# Altium schematic sheet 蓝桥3.SchDoc
size A2
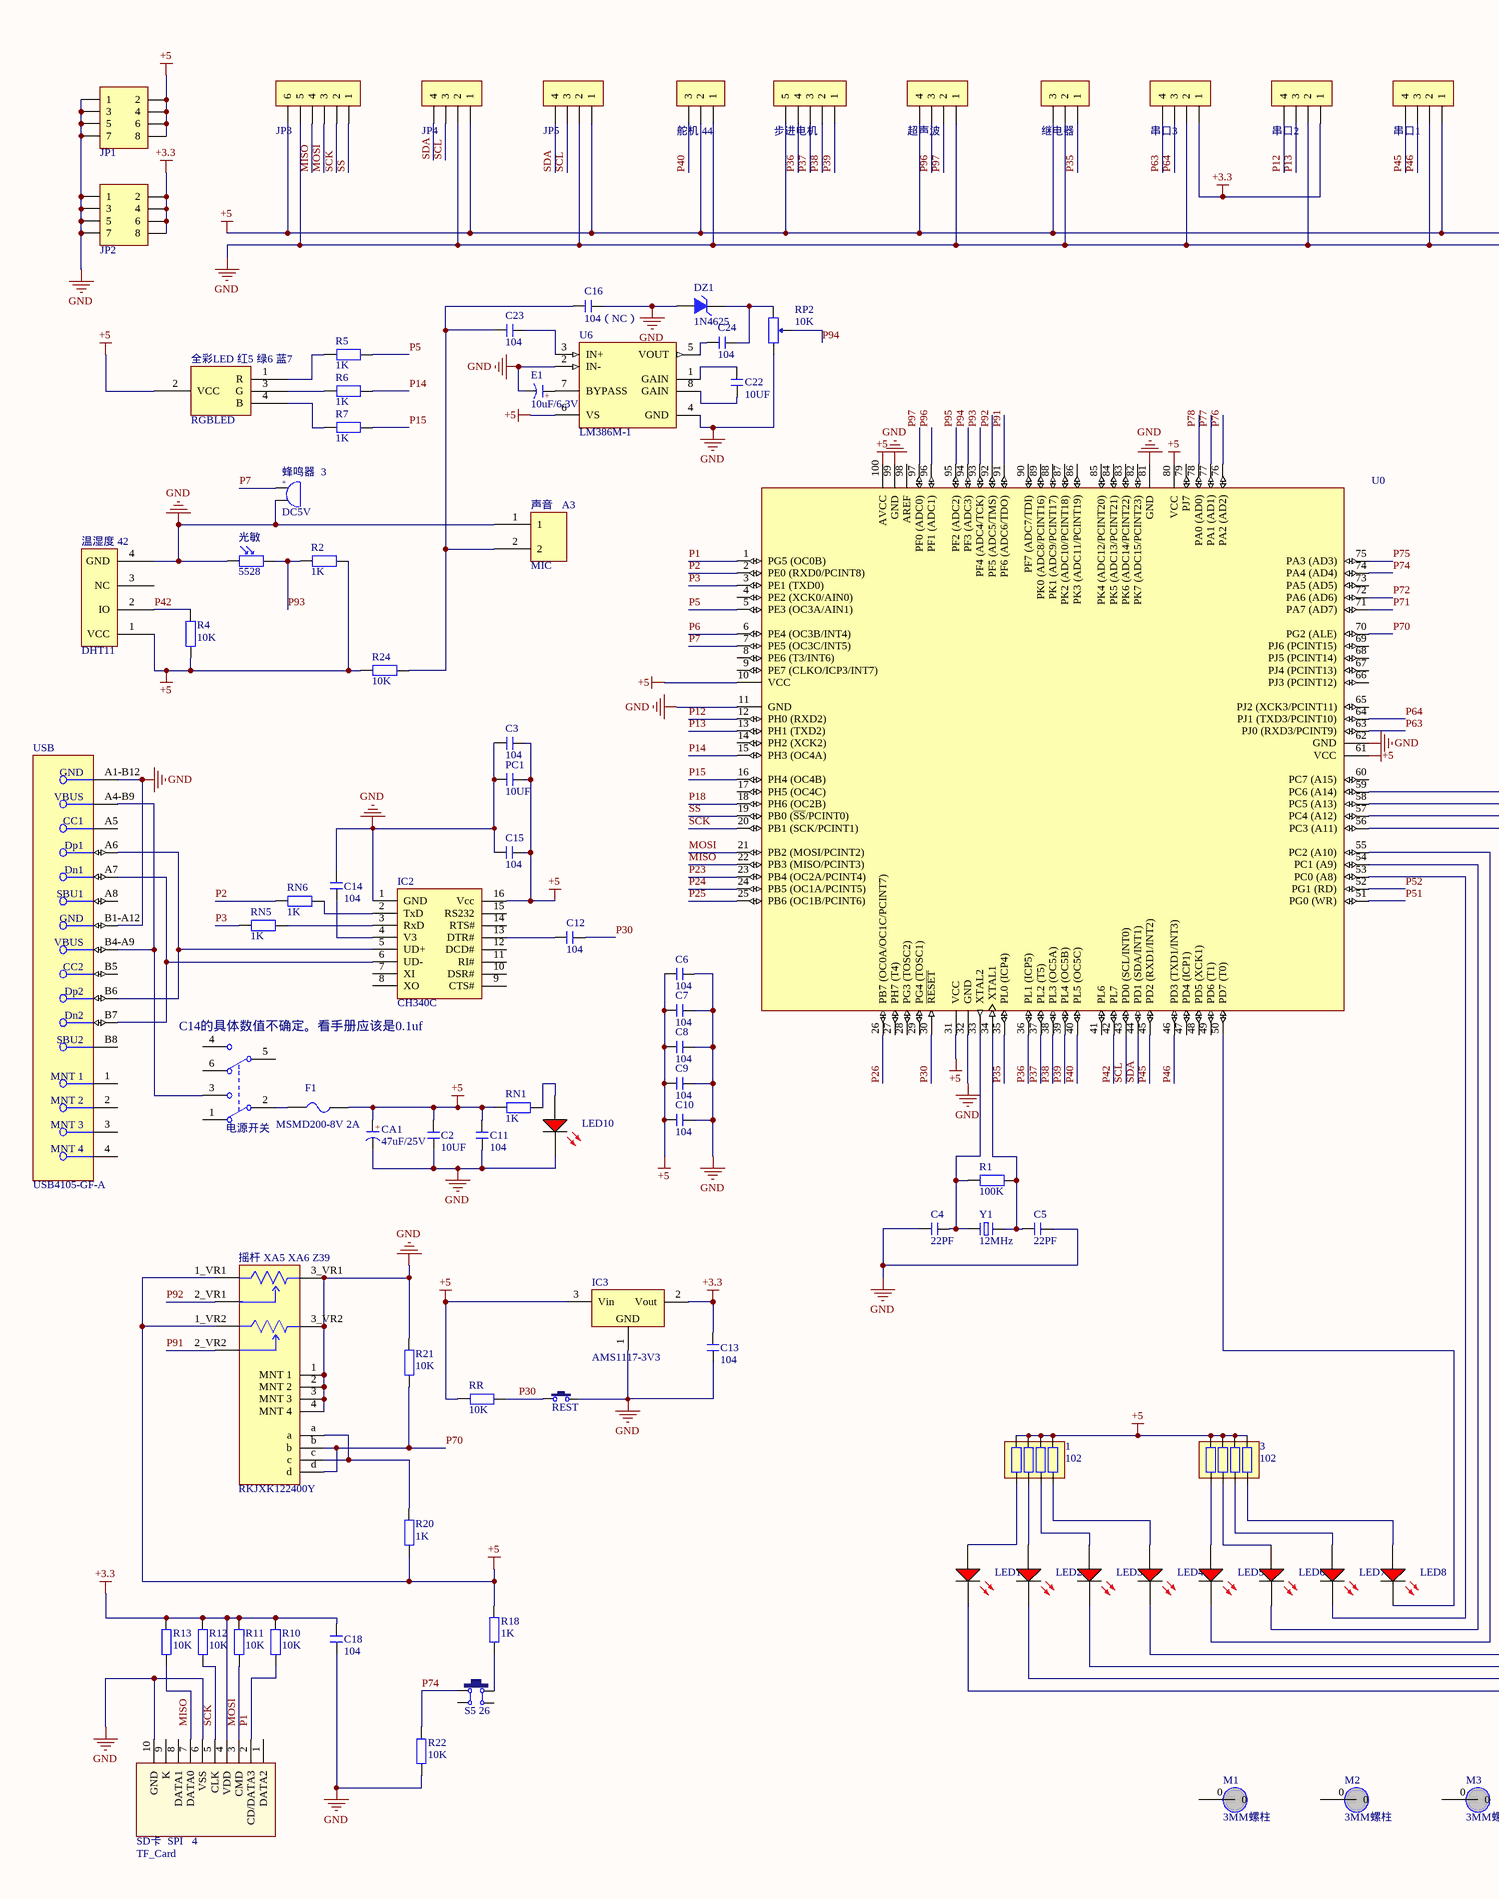
[diagram p0: 蓝桥3.SchDoc, left]
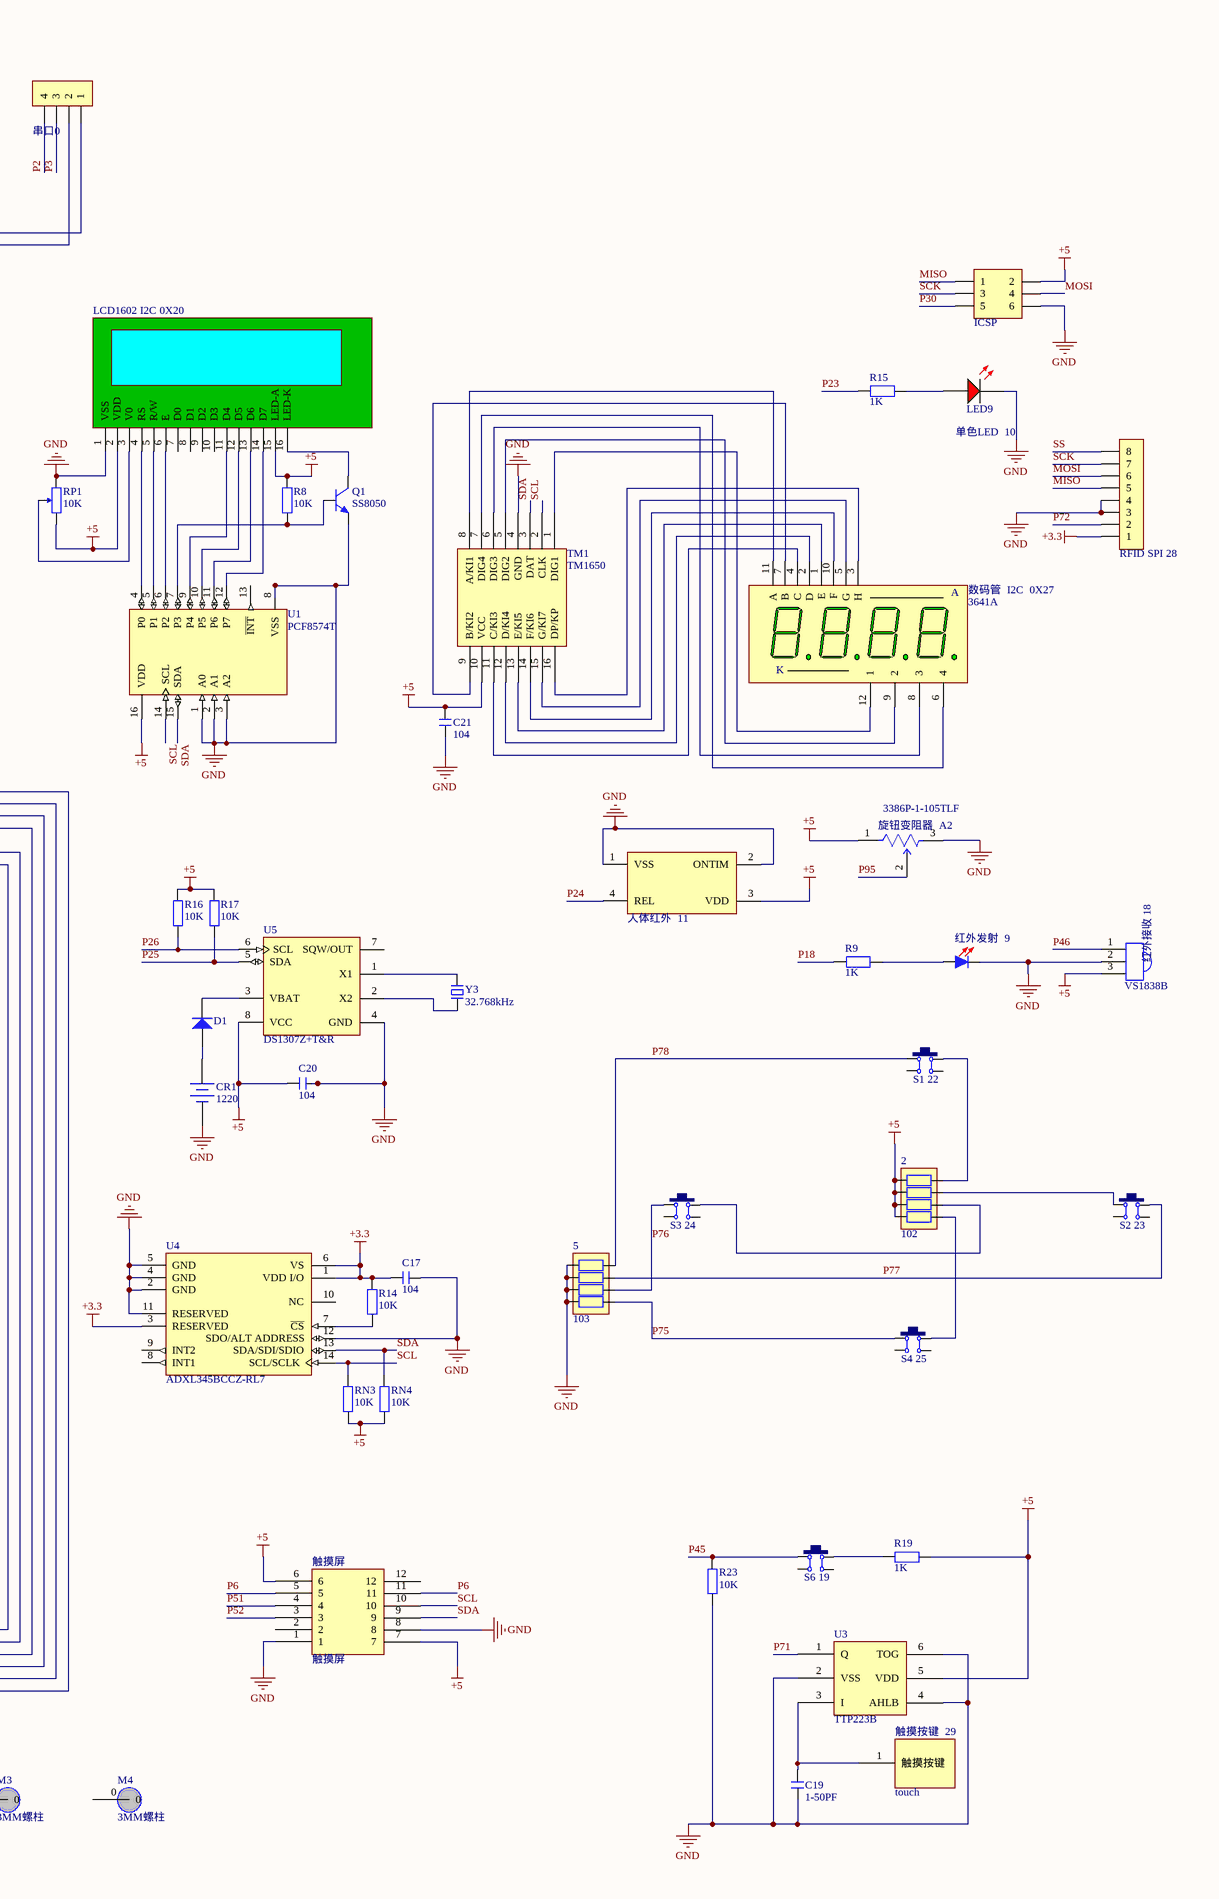
[diagram p1: 蓝桥3.SchDoc, right]

## Parts
1  102  [RCA-8P4R-0603]
2  102  [RCA-8P4R-0603]
3  102  [RCA-8P4R-0603]
5  103  [RCA-8P4R-0603]
C2  10UF  [C 0805_L]
C3  104  [C 0805_L]
C4  22PF  [C 0805_L]
C5  22PF  [C 0805_L]
C6  104  [C 0805_L]
C7  104  [C 0805_L]
C8  104  [C 0805_L]
C9  104  [C 0805_L]
C10  104  [C 0805_L]
C11  104  [C 0805_L]
C12  104  [C 0805_L]
C13  104  [C 0805_L]
C14  104  [C 0805_L]
C15  104  [C 0805_L]
C16  104（NC）  [C 0805_L]
C17  104  [C 0805_L]
C18  104  [C 0805_L]
C19  1-50PF  [C 0805_L]
C20  104  [C 0805_L]
C21  104  [C 0805_L]
C22  10UF  [C 0805_L]
C23  104  [C 0805_L]
C24  104  [C 0805_L]
CA1  47uF/25V  [CM D(6.3*5.4)]
CR1  1220  [CR1220_A]
D1  (no value)  [MINI_MELF (LL34)]
DZ1  1N4625  [MINI_MELF (LL34)]
E1  10uF/6.3V  [CD A(3216)]
F1  MSMD200-8V 2A  [FU 1812]
IC2  CH340C  [SOP16_L]
IC3  AMS1117-3V3  [SOT89_N]
ICSP  Header3X2  [HDR2.54-LI-2x3P]  (value not drawn)
JP1  Header 4X2  [HDR2.54-LI-2x4P]  (value not drawn)
JP2  Header 4X2  [HDR2.54-LI-2x4P]  (value not drawn)
JP3  HDR-1X6  [XH2.54-WI-6P]  (value not drawn)
JP4  HDR-1X4  [XH2.54-WI-4P]  (value not drawn)
JP5  HDR-1X4  [XH2.54-WI-4P]  (value not drawn)
LCD1602_I2C_0X20  LCD 1602  [LCD-1602]  (value not drawn)
LED1  31  [LUMX-SML-LXT0805_V]  (value not drawn)
LED2  32  [LUMX-SML-LXT0805_V]  (value not drawn)
LED3  33  [LUMX-SML-LXT0805_V]  (value not drawn)
LED4  34  [LUMX-SML-LXT0805_V]  (value not drawn)
LED5  35  [LUMX-SML-LXT0805_V]  (value not drawn)
LED6  36  [LUMX-SML-LXT0805_V]  (value not drawn)
LED7  37  [LUMX-SML-LXT0805_V]  (value not drawn)
LED8  38  [LUMX-SML-LXT0805_V]  (value not drawn)
LED9  38  [LUMX-SML-LXT0805_V]  (value not drawn)
LED10  31  [LUMX-SML-LXT0805_V]  (value not drawn)
M1  3MM螺柱  [3mm螺柱]
M2  3MM螺柱  [3mm螺柱]
M3  3MM螺柱  [3mm螺柱]
M4  3MM螺柱  [3mm螺柱]
PC1  10UF  [C 0805_L]
Q1  SS8050  [SOT23-3N]
R1  100K  [R 0805_L]
R2  1K  [R 0805_L]
R4  10K  [R 0805_L]
R5  1K  [R 0805_L]
R6  1K  [R 0805_L]
R7  1K  [R 0805_L]
R8  10K  [R 0805_L]
R9  1K  [R 0805_L]
R10  10K  [R 0805_L]
R11  10K  [R 0805_L]
R12  10K  [R 0805_L]
R13  10K  [R 0805_L]
R14  10K  [R 0805_L]
R15  1K  [R 0805_L]
R16  10K  [R 0805_L]
R17  10K  [R 0805_L]
R18  1K  [R 0805_L]
R19  1K  [R 0805_L]
R20  1K  [R 0805_L]
R21  10K  [R 0805_L]
R22  10K  [R 0805_L]
R23  10K  [R 0805_L]
R24  10K  [R 0805_L]
REST  3x6x5  [TSW SMD-3*6*2.5]  (value not drawn)
RFID_SPI_28  HDR-1X8  [XH2.54-WI-8P]  (value not drawn)
RN1  1K  [R 0805_L]
RN3  10K  [R 0805_L]
RN4  10K  [R 0805_L]
RN5  1K  [R 0805_L]
RN6  1K  [R 0805_L]
RP1  10K  [3303W]
RP2  10K  [3303W]
RR  10K  [R 0805_L]
S1_22  12x12x5  [TSW DIP-12*12*4.3]  (value not drawn)
S2_23  12x12x5  [TSW DIP-12*12*4.3]  (value not drawn)
S3_24  12x12x5  [TSW DIP-12*12*4.3]  (value not drawn)
S4_25  12x12x5  [TSW DIP-12*12*4.3]  (value not drawn)
S5_26  12x12x5  [TSW DIP-12*12*4.3]  (value not drawn)
S6_19  12x12x5  [TSW DIP-12*12*4.3]  (value not drawn)
SD卡_SPI_4  TF_Card  [Micro SD]
TM1  TM1650  [SOP16]
U0  atmega2560  [LQFP100 14x14_M]  (value not drawn)
U1  PCF8574T  [FP-SOT162-1-MFG]
U3  TTP223B  [SOT23-6]
U4  ADXL345BCCZ-RL7  [ADI-CC-14-1_V]
U5  DS1307Z+T&R  [S8+2_L]
U6  LM386M-1  [D0008A_M]
USB  USB4105-GF-A  [FP-USB4105-GF-A-MFG]
Y1  12MHz  [OSC HC-49S]
Y3  32.768kHz  [OSC-3x8-WI-A]
串口0  HDR-1X4  [XH2.54-WI-4P]  (value not drawn)
串口1  HDR-1X4  [XH2.54-WI-4P]  (value not drawn)
串口2  HDR-1X4  [XH2.54-WI-4P]  (value not drawn)
串口3  HDR-1X4  [XH2.54-WI-4P]  (value not drawn)
人体红外_11  BM412  [BM412]  (value not drawn)
光敏  5528  [RG5528]
全彩LED_红5_绿6_蓝7  RGBLED  [RGB10MM]
声音_A3  MIC  [MIC]
摇杆_XA5_XA6_Z39  RKJXK122400Y  [FP-RKJXK122400Y-MFG]
数码管_I2C_0X27  3641A  [SMG 0.36-4P]
旋钮变阻器_A2  3386P-1-105TLF  [FP-3386P-MFG]
步进电机  HDR-1X5  [XH2.54-WI-5P]  (value not drawn)
温湿度_42  DHT11  [DHT11]
电源开关  KET 7X7  [KFT DIP-7X7]  (value not drawn)
红外发射_9  (no value)  [I-LED-5MM]
红外接收_18  VS1838B  [VS1838B-B]
继电器  HDR-1X3  [XH2.54-WI-3P]  (value not drawn)
舵机_44  HDR-1X3  [XH2.54-WI-3P]  (value not drawn)
蜂鸣器_3  DC5V  [BEEP 6.5x12x6]
触摸屏  触摸屏  [触摸屏]
触摸按键_29  touch  [TOUCH]
超声波  HDR-1X4  [XH2.54-WI-4P]  (value not drawn)

## Nets
+3.3: C13.2 C17.1 C18.2 IC3.2(Vout) JP2.2 JP2.4 JP2.6 JP2.8 R10.1 R11.2 R12.2 R13.2 R14.2 RFID_SPI_28.1 SD卡_SPI_4.4(VDD) U4.1(VDD_I/O) U4.3(RESERVED) U4.6(VS) 串口2.1 串口3.1
+5: 1.5 1.6 1.7 1.8 2.1 2.2 2.3 2.4 3.5 3.6 3.7 3.8 C2.2 C3.2 C6.1 C7.1 C8.1 C9.1 C10.1 C11.2 C15.1 C20.1 C21.2 CA1.1(A) F1.1 IC2.16(Vcc) IC3.3(Vin) ICSP.2 JP1.2 JP1.4 JP1.6 JP1.8 JP3.6 JP4.1 JP5.1 LCD1602_I2C_0X20.2(VDD) LCD1602_I2C_0X20.15(LED-A) PC1.2 R2.1 R4.1 R8.1 R16.2 R17.2 R18.2 R19.1 R20.1 R24.2 RN1.1 RN3.1 RN4.1 RP1.1 RR.1 TM1.10(VCC) U0.10(VCC) U0.31(VCC) U0.61(VCC) U0.80(VCC) U0.100(AVCC) U1.16(VDD) U3.5(VDD) U5.8(VCC) U6.6(VS) 串口0.1 串口1.1 人体红外_11.3(VDD) 全彩LED_红5_绿6_蓝7.2(VCC) 摇杆_XA5_XA6_Z39.1_VR1(1_VR1) 摇杆_XA5_XA6_Z39.1_VR2(1_VR2) 旋钮变阻器_A2.1(CCW) 步进电机.5 温湿度_42.1(VCC) 红外接收_18.3(E) 继电器.3 舵机_44.2 触摸屏.6 触摸屏.7 超声波.4
GND: 5.1 5.2 5.3 5.4 C2.1 C3.1 C4.1 C5.1 C6.2 C7.2 C8.2 C9.2 C10.2 C11.1 C13.1 C14.1 C15.2 C16.1 C17.2 C18.1 C19.1 C20.2 C21.1 CA1.2(K) CR1.2(DC-) DZ1.1(A) E1.2(K) IC2.1(GND) IC3.1(GND) ICSP.6 JP1.1 JP1.3 JP1.5 JP1.7 JP2.1 JP2.3 JP2.5 JP2.7 JP3.5 JP4.2 JP5.2 LCD1602_I2C_0X20.1(VSS) LED9.2(K) LED10.2(K) PC1.1 Q1.2(E) R21.2 R22.1 R23.1 REST.2 RFID_SPI_28.3 RFID_SPI_28.4 RP1.3 RP2.3 SD卡_SPI_4.6(VSS) SD卡_SPI_4.10(GND) TM1.4(GND) U0.11(GND) U0.32(GND) U0.62(GND) U0.81(GND) U0.99(GND) U1.1(A0) U1.2(A1) U1.3(A2) U1.8(VSS) U3.2(VSS) U3.4(AHLB) U3.6(TOG) U4.2(GND) U4.4(GND) U4.5(GND) U4.11(RESERVED) U4.12(SDO/ALT_ADDRESS) U5.4(GND) U6.2(IN-) U6.4(GND) USB.A1-B12(GND) USB.B1-A12(GND) 串口0.2 串口1.2 串口2.2 串口3.2 人体红外_11.1(VSS) 人体红外_11.2(ONTIM) 光敏.2 声音_A3.1 摇杆_XA5_XA6_Z39.1(MNT_1) 摇杆_XA5_XA6_Z39.2(MNT_2) 摇杆_XA5_XA6_Z39.3(MNT_3) 摇杆_XA5_XA6_Z39.3_VR1(3_VR1) 摇杆_XA5_XA6_Z39.3_VR2(3_VR2) 摇杆_XA5_XA6_Z39.4(MNT_4) 旋钮变阻器_A2.3(CW) 温湿度_42.4(GND) 红外发射_9.2(K) 红外接收_18.2(K) 继电器.2 舵机_44.1 蜂鸣器_3.2 触摸屏.1 触摸屏.8 超声波.1
MISO: ICSP.1 JP3.4 R13.1 RFID_SPI_28.5 SD卡_SPI_4.7(DATA0) U0.22(PB3_(MISO/PCINT3))
MOSI: ICSP.4 JP3.3 R11.1 RFID_SPI_28.6 SD卡_SPI_4.3(CMD) U0.21(PB2_(MOSI/PCINT2))
P1: R10.2 SD卡_SPI_4.2(CD/DATA3) U0.1(PG5_(OC0B))
P2: RN6.2 U0.2(PE0_(RXD0/PCINT8)) 串口0.4
P3: RN5.2 U0.3(PE1_(TXD0)) 串口0.3
P5: R5.2 U0.5(PE3_(OC3A/AIN1))
P6: U0.6(PE4_(OC3B/INT4)) 触摸屏.5 触摸屏.11
P7: U0.7(PE5_(OC3C/INT5)) 蜂鸣器_3.1
P12: U0.12(PH0_(RXD2)) 串口2.4
P13: U0.13(PH1_(TXD2)) 串口2.3
P14: R6.2 U0.15(PH3_(OC4A))
P15: R7.2 U0.16(PH4_(OC4B))
P18: R9.1 U0.18(PH6_(OC2B))
P23: R15.1 U0.23(PB4_(OC2A/PCINT4))
P24: U0.24(PB5_(OC1A/PCINT5)) 人体红外_11.4(REL)
P25: R17.1 U0.25(PB6_(OC1B/PCINT6)) U5.5(SDA)
P26: R16.1 U0.26(PB7_(OC0A/OC1C/PCINT7)) U5.6(SCL)
P30: C12.1 ICSP.5 REST.1 RR.2 U0.30(~{RESET})
P35: U0.35(PL0_(ICP4)) 继电器.1
P36: U0.36(PL1_(ICP5)) 步进电机.4
P37: U0.37(PL2_(T5)) 步进电机.3
P38: U0.38(PL3_(OC5A)) 步进电机.2
P39: U0.39(PL4_(OC5B)) 步进电机.1
P40: U0.40(PL5_(OC5C)) 舵机_44.3
P42: R4.2 U0.42(PL7) 温湿度_42.2(IO)
P45: R23.2 S6_19.1 U0.45(PD2_(RXD1/INT2)) 串口1.4
P46: U0.46(PD3_(TXD1/INT3)) 串口1.3 红外接收_18.1(A)
P51: U0.51(PG0_(WR)) 触摸屏.4
P52: U0.52(PG1_(RD)) 触摸屏.3
P63: U0.63(PJ0_(RXD3/PCINT9)) 串口3.4
P64: U0.64(PJ1_(TXD3/PCINT10)) 串口3.3
P70: R21.1 U0.70(PG2_(ALE)) 摇杆_XA5_XA6_Z39.b 摇杆_XA5_XA6_Z39.d
P71: U0.71(PA7_(AD7)) U3.1(Q)
P72: RFID_SPI_28.2 U0.72(PA6_(AD6))
P74: R22.2 S5_26.1 U0.74(PA4_(AD4))
P75: 5.5 S4_25.1 U0.75(PA3_(AD3))
P76: 5.6 S3_24.1 U0.76(PA2_(AD2))
P77: 5.7 S2_23.2 U0.77(PA1_(AD1))
P78: 5.8 S1_22.1 U0.78(PA0_(AD0))
P91: U0.91(PF6_(ADC6/TDO)) 摇杆_XA5_XA6_Z39.2_VR2(2_VR2)
P92: U0.92(PF5_(ADC5/TMS)) 摇杆_XA5_XA6_Z39.2_VR1(2_VR1)
P93: R2.2 U0.93(PF4_(ADC4/TCK)) 光敏.1
P94: RP2.2 U0.94(PF3_(ADC3))
P95: U0.95(PF2_(ADC2)) 旋钮变阻器_A2.2(WIPER)
P96: U0.96(PF1_(ADC1)) 超声波.3
P97: U0.97(PF0_(ADC0)) 超声波.2
SCK: ICSP.3 JP3.2 R12.1 RFID_SPI_28.7 SD卡_SPI_4.5(CLK) U0.20(PB1_(SCK/PCINT1))
SCL: JP4.3 JP5.3 RN3.2 TM1.2(CLK) U0.43(PD0_(SCL/INT0)) U1.14(SCL) U4.14(SCL/SCLK) 触摸屏.10
SDA: JP4.4 JP5.4 RN4.2 TM1.3(DAT) U0.44(PD1_(SDA/INT1)) U1.15(SDA) U4.13(SDA/SDI/SDIO) 触摸屏.9
SS: JP3.1 RFID_SPI_28.8 U0.19(PB0_(~{SS}/PCINT0))
Net1_1: 1.1 LED1.1(A)
Net1_2: 1.2 LED2.1(A)
Net1_3: 1.3 LED3.1(A)
Net1_4: 1.4 LED4.1(A)
Net2_5: 2.5 S4_25.2
Net2_6: 2.6 S3_24.2
Net2_7: 2.7 S2_23.1
Net2_8: 2.8 S1_22.2
Net3_1: 3.1 LED5.1(A)
Net3_2: 3.2 LED6.1(A)
Net3_3: 3.3 LED7.1(A)
Net3_4: 3.4 LED8.1(A)
NetC4_2: C4.2 R1.1 U0.33(XTAL2) Y1.1
NetC5_2: C5.2 R1.2 U0.34(XTAL1) Y1.2
NetC12_2: C12.2 IC2.13(DTR#)
NetC14_2: C14.2 IC2.4(V3)
NetC16_2: C16.2 C23.1 R24.1 声音_A3.2
NetC19_2: C19.2 U3.3(I) 触摸按键_29.1(触摸按键)
NetC22_1: C22.1 U6.8(GAIN)
NetC22_2: C22.2 U6.1(GAIN)
NetC23_2: C23.2 U6.3(IN+)
NetC24_1: C24.1 U6.5(VOUT)
NetC24_2: C24.2 DZ1.2(K) RP2.1
NetCR1_1: CR1.1(DC+) D1.1(A)
NetD1_2: D1.2(K) U5.3(VBAT)
NetE1_1: E1.1(A) U6.7(BYPASS)
NetF1_2: F1.2 电源开关.2(COM2)
NetIC2_2: IC2.2(TxD) RN6.1
NetIC2_3: IC2.3(RxD) RN5.1
NetIC2_5: IC2.5(UD+) USB.A6(Dp1) USB.B6(Dp2)
NetIC2_6: IC2.6(UD-) USB.A7(Dn1) USB.B7(Dn2)
NetLCD1602_I2C_0X20_3: LCD1602_I2C_0X20.3(V0) RP1.2
NetLCD1602_I2C_0X20_4: LCD1602_I2C_0X20.4(RS) U1.4(P0)
NetLCD1602_I2C_0X20_5: LCD1602_I2C_0X20.5(R/W) U1.5(P1)
NetLCD1602_I2C_0X20_6: LCD1602_I2C_0X20.6(E) U1.6(P2)
NetLCD1602_I2C_0X20_11: LCD1602_I2C_0X20.11(D4) U1.9(P4)
NetLCD1602_I2C_0X20_12: LCD1602_I2C_0X20.12(D5) U1.10(P5)
NetLCD1602_I2C_0X20_13: LCD1602_I2C_0X20.13(D6) U1.11(P6)
NetLCD1602_I2C_0X20_14: LCD1602_I2C_0X20.14(D7) U1.12(P7)
NetLCD1602_I2C_0X20_16: LCD1602_I2C_0X20.16(LED-K) Q1.3(C)
NetLED1_2: LED1.2(K) U0.59(PC6_(A14))
NetLED2_2: LED2.2(K) U0.58(PC5_(A13))
NetLED3_2: LED3.2(K) U0.57(PC4_(A12))
NetLED4_2: LED4.2(K) U0.56(PC3_(A11))
NetLED5_2: LED5.2(K) U0.55(PC2_(A10))
NetLED6_2: LED6.2(K) U0.54(PC1_(A9))
NetLED7_2: LED7.2(K) U0.53(PC0_(A8))
NetLED8_2: LED8.2(K) U0.50(PD7_(T0))
NetLED9_1: LED9.1(A) R15.2
NetLED10_1: LED10.1(A) RN1.2
NetQ1_1: Q1.1(B) R8.2 U1.7(P3)
NetR5_1: R5.1 全彩LED_红5_绿6_蓝7.1(R)
NetR6_1: R6.1 全彩LED_红5_绿6_蓝7.3(G)
NetR7_1: R7.1 全彩LED_红5_绿6_蓝7.4(B)
NetR9_2: R9.2 红外发射_9.1(A)
NetR14_1: R14.1 U4.7(~{CS})
NetR18_1: R18.1 S5_26.2
NetR19_2: R19.2 S6_19.2
NetR20_2: R20.2 摇杆_XA5_XA6_Z39.a 摇杆_XA5_XA6_Z39.c
NetTM1_1: TM1.1(DIG1) 数码管_I2C_0X27.12(1)
NetTM1_5: TM1.5(DIG2) 数码管_I2C_0X27.9(2)
NetTM1_6: TM1.6(DIG3) 数码管_I2C_0X27.8(3)
NetTM1_7: TM1.7(DIG4) 数码管_I2C_0X27.6(4)
NetTM1_8: TM1.8(A/KI1) 数码管_I2C_0X27.11(A)
NetTM1_9: TM1.9(B/KI2) 数码管_I2C_0X27.7(B)
NetTM1_11: TM1.11(C/KI3) 数码管_I2C_0X27.4(C)
NetTM1_12: TM1.12(D/KI4) 数码管_I2C_0X27.2(D)
NetTM1_13: TM1.13(E/KI5) 数码管_I2C_0X27.1(E)
NetTM1_14: TM1.14(F/KI6) 数码管_I2C_0X27.10(F)
NetTM1_15: TM1.15(G/KI7) 数码管_I2C_0X27.5(G)
NetTM1_16: TM1.16(DP/KP) 数码管_I2C_0X27.3(H)
NetU5_1: U5.1(X1) Y3.1
NetU5_2: U5.2(X2) Y3.2
NetUSB_A4-B9: USB.A4-B9(VBUS) USB.B4-A9(VBUS) 电源开关.3(NO1)

Not connected (* = marked no-connect by the designer): IC2 7(XI) 8(XO) 9(CTS#) 10(DSR#) 11(RI#) 12(DCD#) 14(RTS#) 15(RS232); LCD1602_I2C_0X20 7(D0) 8(D1) 9(D2) 10(D3); M1 0; M2 0; M3 0; M4 0; S1_22 3 4; S2_23 3 4; S3_24 3 4; S4_25 3 4; S5_26 3 4; S6_19 3 4; SD卡_SPI_4 1(DATA2) 8(DATA1) 9(K); U0 4(PE2_(XCK0/AIN0)) 8(PE6_(T3/INT6)) 9(PE7_(CLKO/ICP3/INT7)) 14(PH2_(XCK2)) 17(PH5_(OC4C)) 27(PH7_(T4)) 28(PG3_(TOSC2)) 29(PG4_(TOSC1)) 41(PL6) 47(PD4_(ICP1)) 48(PD5_(XCK1)) 49(PD6_(T1)) 60(PC7_(A15)) 65(PJ2_(XCK3/PCINT11)) 66(PJ3_(PCINT12)) 67(PJ4_(PCINT13)) 68(PJ5_(PCINT14)) 69(PJ6_(PCINT15)) 73(PA5_(AD5)) 79(PJ7) 82(PK7_(ADC15/PCINT23)) 83(PK6_(ADC14/PCINT22)) 84(PK5_(ADC13/PCINT21)) 85(PK4_(ADC12/PCINT20)) 86(PK3_(ADC11/PCINT19)) 87(PK2_(ADC10/PCINT18)) 88(PK1_(ADC9/PCINT17)) 89(PK0_(ADC8/PCINT16)) 90(PF7_(ADC7/TDI)) 98(AREF); U1 13(~{INT}); U4 8(INT1) 9(INT2) 10(NC); U5 7(SQW/OUT); USB 1(MNT_1) 2(MNT_2) 3(MNT_3) 4(MNT_4) A5(CC1) A8(SBU1) B5(CC2) B8(SBU2); 温湿度_42 3(NC); 电源开关 1(NC1) 4(NO2) 5(COM2) 6(NC2); 触摸屏 2 12

## Notes on the sheet
- (near LED9) 单色LED  10
- (near 电源开关) C14的具体数值不确定。看手册应该是0.1uf
- (in symbol 3641A) K
- (in symbol BEEP) +
- (in symbol C-CD) +
- (in symbol C-CM) +

## Library data of the parts
1-3 5 = R-8P4R: 贴片网络排阻; 版权归属: 源创客; BOM名称: 贴片网络排阻; 学习资源: www.ooocke.com
C2-C24 PC1 = C: 无极性贴片电容; 版权归属: 源创客; BOM名称: 无极性贴片电容; 学习资源: www.ooocke.com
CA1 = C-CM: 贴片电解电容; 版权归属: 源创客; BOM名称: 贴片电解电容; 学习资源: www.ooocke.com
CR1 = CR-3V: 微型电池; 版权归属: 源创客; BOM名称: 微型电池; 学习资源: www.ooocke.com
D1 = 1N4148: 高速开关二极管; 版权归属: 源创客; BOM名称: 高速开关二极管; 学习资源: www.ooocke.com
DZ1 = 1N4625: 5.1V/0.5W稳压管; 版权归属: 源创客; BOM名称: 5.1V/0.5W稳压管; 学习资源: www.ooocke.com
E1 = C-CD: 贴片钽电容; 版权归属: 源创客; BOM名称: 贴片钽电容; 学习资源: www.ooocke.com
F1 = FU: 贴片保险丝; 版权归属: 源创客; BOM名称: 贴片保险丝; 学习资源: www.ooocke.com
IC2 = CH340G: 串口转USB; 版权归属: 源创客; BOM名称: 串口转USB; 学习资源: www.ooocke.com
IC3 = AMS1117: 三端稳压芯片; BOM名称: 稳压芯片; 版权归属: 源创客; 学习资源: www.ooocke.com
ICSP = Header 3X2: 3*2P接插件; 版权归属: 源创客; BOM名称: 3*2P接插件; 学习资源: www.ooocke.com
JP1 JP2 = Header 4X2: 4*2P接插件; 版权归属: 源创客; BOM名称: 4*2P接插件; 学习资源: www.ooocke.com
JP3 = Header 6: 6P接插件; 版权归属: 源创客; BOM名称: 6P接插件; 学习资源: www.ooocke.com
JP4 JP5 串口0-串口3 超声波 = Header 4: 4P接插件; 版权归属: 源创客; BOM名称: 4P接插件; 学习资源: www.ooocke.com
LCD1602_I2C_0X20 = LCD 1602: 版权归属: 源创客; BOM名称: LCD 1602; 学习资源: www.ooocke.com
LED1-LED10 = CMP-1724-00002-1: LED, RED, 635 nm, 2 V, -25 to 80 degC, 2-Pin SMD, RoHS, Tape and Reel; Case\/Package: 0805; ComponentLink2URL: http://www.lumex.com/content/files/ProductAttachment/219201631403-SML-LXT0805IW-TR.pdf; DatasheetVersion: Rev. F, 09/2009; Width: 1.25 mm; PackageReference: SML-LXT0805; Min Operating Temperature: -25 degC; Mounting Technology: Surface Mount; Packaging: Cut Tape; Case Code (Metric): 2012; RoHSCompliant: true; ComponentLink2Description: Datasheet; ComponentLink1Description: Manufacturer URL; ComponentLink1URL: http://www.lumexinstruments.com/; Mount: Surface Mount; Package Quantity: 1; PackageDescription: 2-Pin Surface Mount Device, Body 2 x 1.25 mm; Max Operating Temperature: 80 degC; REACH SVHC: No SVHC; Case Code (Imperial): 0805; Length: 2 mm
Q1 = 8050-SMD: 高频放大-NPN型; 版权归属: 源创客; 属性: 40V 1.5A 1W 100MHZ; BOM名称: 高频放大-NPN型; 学习资源: www.ooocke.com
R1 R2 R4-R24 RN1 RN3-RN6 RR = R: 贴片电阻; 版权归属: 源创客; BOM名称: 贴片电阻; 学习资源: www.ooocke.com
REST = TSW 3x6: 3x6轻触开关; 版权归属: 源创客; BOM名称: 3x6轻触开关; 学习资源: www.ooocke.com
RFID_SPI_28 = Header 8: 8P接插件; 版权归属: 源创客; BOM名称: 8P接插件; 学习资源: www.ooocke.com
RP1 RP2 = RP-SMD: 贴片电位器; 版权归属: 源创客; BOM名称: 贴片电位器; 学习资源: www.ooocke.com
S1_22 S2_23 S3_24 S4_25 S5_26 S6_19 = TSW DIP-12x12: 直插12x12轻触开关; 版权归属: 源创客; BOM名称: 直插12x12轻触开关; 学习资源: www.ooocke.com
SD卡_SPI_4 = TF_Card: TF卡座; 版权归属: 源创客; BOM名称: TF卡座; 学习资源: www.ooocke.com
U1 = CMP-10112-000003-1: IC I/O EXPANDER I2C 8B 16SOIC; Manufacturer: NXP Semiconductors; Manufacturer Part Number: PCF8574AT/3,518; Interface: I2C,SMBus; Frequency: 100kHz; Nominal Supply Current: 40uA; Max Supply Voltage: 6V; Number Of I/Os: 8; Max Junction Temp: +125°C; Min Supply Voltage: 2.5V; Standoff Height: 0.1mm; RoHS: TRUE; Category: IC; Temperature: -40°C to +85°C; Device Class L3: I/O Expanders; ComponentLink2Description: Datasheet; ComponentLink2URL: https://www.nxp.com/docs/en/data-sheet/PCF8574_PCF8574A.pdf; Digikey Description: IC I/O EXPANDER I2C 8B 16SOIC; Ipc Land Pattern Name: SOIC127P1032X265-16; Mouser Description: PCF8574 Series 2.5 to 6V Remote 8-bit I/O Expander for I2C-bus -SOIC-16; Footprint Url: https://www.nxp.com/docs/en/package-information/SOT162-1.pdf; Lead Free: Yes; Device Class L2: Interface ICs; Ambient Temperature Range Low: -40°C; Temperature Range High: +85°C; Automotive: No; Ambient Temperature Range High: +85°C; Height: 2.65mm; Package: SOT162-1; Temperature Range Low: -40°C; Octopart: https://octopart.com/pcf8574at%2F3%2C518-nxp+semiconductors-11541925; Device Class L1: Integrated Circuits (ICs)
U4 = CMP-0885-00033-1: 3-Axis, +/-2 g / +/-4 g / +/-8 g / +/-16 g Digital Accelerometer with Digital Output, 1.6 KHz BW, Industrial, 14-pin LGA, Reel; Manufacturer: Analog Devices; Supply Current: 140 uA; Voltage Supply (V): 2.0 to 3.6; -3dB Bandwidth: 1.6 KHz; Sensitivity: 256/128/64/32 LSB/g; # of Axes: 3; Output Type: Digital; PackageDescription: 14-Pin Land Grid Array, 3 x 5 mm Body, 0.8 mm Pitch; ComponentLink1URL: http://www.analog.com/en/index.html; ComponentLink2Description: Datasheet; PartNumber: ADXL345BCCZ-RL7; ComponentLink3Description: Package Specification; ComponentLink4URL: http://www.analog.com/en/mems-sensors/mems-inertial-sensors/adxl345/products/product.html; PackageVersion: 03-16-2010-A, 03/2010; ComponentLink1Description: Manufacturer URL; ComponentLink2URL: http://www.analog.com/static/imported-files/data_sheets/ADXL345.pdf; DatasheetVersion: Rev. D; PackageReference: CC-14-1; Packing: Reel; Mounting Technology: Surface Mount; ComponentLink4Description: Product URL; ComponentLink3URL: http://www.analog.com/static/imported-files/data_sheets/ADXL343.pdf
U5 = CMP-0254-00305-1: 64 x 8, Serial, I2C Real-Time Clock, 5.0V, 8-Pin SO, 0 to 70 degC, Pb-Free, Reel; Code_JEDEC: MS-012-AA; Code_IPC: SOIC127P600-8; ComponentLink2Description: Datasheet; DatasheetVersion: 10-Feb-2008; ComponentLink2URL: http://datasheets.maxim-ic.com/en/ds/DS1307.pdf; PackageVersion: revC, 2010; ComponentLink1Description: Manufacturer URL; PackageDescription: 8-Pin Small-Outline IC, Narrow (0.15in), 1.27 mm Pitch, SOIC (N), Pb-Free; ComponentLink1URL: http://www.maxim-ic.com; ComponentLink3URL: http://pdfserv.maxim-ic.com/package_dwgs/21-0041.PDF; PackageReference: S8+2; ComponentLink3Description: Package Specification
U6 = CMP-0057-00421-3: Low Voltage Audio Power Amplifier, 8-pin Narrow SOIC; Manufacturer: Texas Instruments; PackageTopMarking: NSZXTT*LM386*M-1; CompType: Audio IC; PowerWise: N; ComponentLink1Description: Datasheet URL; Code_IPC: SOIC127P600-8; PackageDescription: SOIC Narrow, 4.9 x 3.9 x 1.45mm, 8 Lead, 1.27mm Pitch; Code_JEDEC: MS-012-AA; PinCount: 8; ComponentLink1URL: http://www.ti.com/general/docs/lit/getliterature.tsp?genericPartNumber=LM386&fileType=pdf; RoHS: N; PackageReference: D0008A
USB = CMP-245163-000001-1: CONN RCPT USB2.0 TYPEC 5A; Manufacturer: GCT; Voltage Rating: 20V; Is Female: yes; Current Rating: 5/6.25/1.25/0.25A; Number Of Contacts: 16; Conn Orientation: Right Angle; Device Class L1: Connectors; Category: Conn; Lead Free: Yes; RoHS: TRUE; Temperature Range High: +85°C; Digikey Description: CONN RCPT USB2.0 TYPEC 5A; Device Class L3: unset; ComponentLink2Description: Datasheet; Manufacturer Part Number: USB4105-GF-A; Package: 0; Usb Standard: USB 2.0; Device Class L2: USB Connectors; Automotive: No; Temperature Range Low: -40°C; Height: 3.46mm; Temperature: -40°C to +85°C; Contact Material: Gold,Nickel; ComponentLink2URL: https://gct.co/files/drawings/usb4105.pdf; Octopart: https://octopart.com/usb4105-gf-a-gct-106627878
Y1 Y3 = XTAL-2P: 2脚无源脚晶振; 版权归属: 源创客; BOM名称: 2脚无源脚晶振; 学习资源: www.ooocke.com
光敏 = IDR: 光敏电阻; 版权归属: 源创客; BOM名称: 光敏电阻; 学习资源: www.ooocke.com
摇杆_XA5_XA6_Z39 = CMP-24118-000005-1: Res POT 10K Ohm 0.0125W (25.4 X 20.7 X 19.3mm) Pin Bracket Mount/Through Hole Tray; Contact Current Rating: 50mA; Power Rating: 12.5mW; Insulation Resistance: 100MR; Resistance: 10kR; Life (Hours): 100Hour; Military Standard: Not; Mount: Through Hole; Max Operating Temperature: 70°C; Radiation Hardening: No; Length: 16mm; Min Operating Temperature: -10°C; Type: Potentiometer; Series: RKJXV/ RKJXK; Depth: 20.7mm; Termination: Pin; Width: 16mm; Package Quantity: 1000; Height: 12.9mm; Resistor Type: Potentiometer; Current Rating: 50mA; RoHS Compliant: Yes; Packaging: Tray
数码管_I2C_0X27 = 3641A: 0.36寸4位共阴数码管; 版权归属: 源创客; BOM名称: 0.36寸4位共阴; 学习资源: www.ooocke.com
旋钮变阻器_A2 = CMP-07234-000020-1: TRIMMER 1M OHM 0.5W PC PIN TOP; Manufacturer: Bourns Inc.; Resistance: 1MΩ; Tolerance: 10%; Value: 1MΩ; Temperature Coefficient: 100ppm/°C; Standoff Height: 0.38mm; ComponentLink2URL: https://www.bourns.com/docs/Product-Datasheets/3386.pdf; Temperature Range High: +125°C; Category: Res; Temperature: -55°C to +125°C; Manufacturer Part Number: 3386P-1-105TLF; Series: 3386; Temperature Range Low: -55°C; Device Class L3: Variable Resistors and Potentiometers; Power Rating: 0.5W; Digikey Description: TRIMMER 1M OHM 0.5W PC PIN TOP; Device Class L1: Passive Components; Package: 3386P; Automotive: No; Octopart: https://octopart.com/3386p-1-105tlf-bourns-2025467; Mouser Description: Trimmer Resistors - Through Hole 3/8 1Mohms 10% 0.5Watts Square; Device Class L2: Resistors; Composition: Cermet; ComponentLink2Description: Datasheet; Height: 5.08mm; RoHS: TRUE; Lead Free: Yes
步进电机 = Header 5: 5P接插件; 版权归属: 源创客; BOM名称: 5P接插件; 学习资源: www.ooocke.com
电源开关 = KET 7X7: 7*7自锁开关; 版权归属: 源创客; BOM名称: 7*7自锁开关; 学习资源: www.ooocke.com
红外发射_9 = I-LED: 红外二极管; 版权归属: 源创客; BOM名称: 红外二极管; 学习资源: www.ooocke.com
红外接收_18 = VS1838B: 红外接收头; 版权归属: 源创客; BOM名称: 红外接收头; 学习资源: www.ooocke.com
继电器 舵机_44 = Header 3: 3P接插件; 版权归属: 源创客; BOM名称: 3P接插件; 学习资源: www.ooocke.com
蜂鸣器_3 = BEEP: 蜂鸣器; 版权归属: 源创客; BOM名称: 蜂鸣器; 学习资源: www.ooocke.com